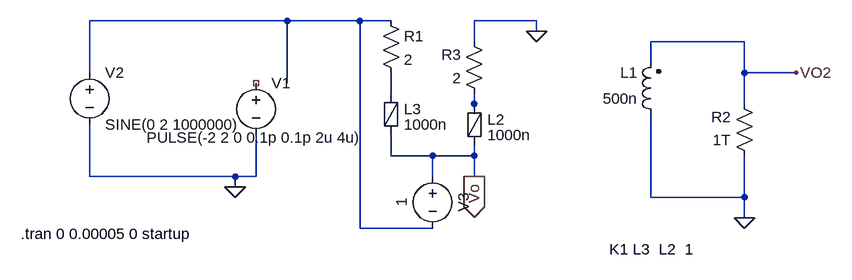
[diagram p0: schematic Draft4.asc]
Draft4.asc, the LTspice schematic file:
Version 4
SHEET 1 880 680
WIRE 0 16 -304 16
WIRE 112 16 0 16
WIRE 160 16 112 16
WIRE 384 16 288 16
WIRE 384 32 384 16
WIRE 288 48 288 16
WIRE 704 48 560 48
WIRE 560 80 560 48
WIRE -304 96 -304 16
WIRE 704 96 704 48
WIRE 784 96 704 96
WIRE 0 112 0 16
WIRE 160 128 160 96
WIRE 288 144 288 128
WIRE 704 144 704 96
WIRE 288 160 288 144
WIRE 160 224 160 192
WIRE 224 224 160 224
WIRE 288 224 288 208
WIRE 288 224 224 224
WIRE -304 256 -304 176
WIRE -80 256 -304 256
WIRE -48 256 -48 192
WIRE -48 256 -80 256
WIRE 224 256 224 224
WIRE 288 256 288 224
WIRE -80 272 -80 256
WIRE 560 288 560 160
WIRE 704 288 704 224
WIRE 704 288 560 288
WIRE 704 320 704 288
WIRE 112 336 112 16
WIRE 224 336 112 336
FLAG 288 256 Vo
IOPIN 288 256 Out
FLAG -80 272 0
FLAG 784 96 VO2
FLAG 704 320 0
FLAG 384 32 0
SYMBOL FerriteBead 160 160 R0
SYMATTR InstName L3
SYMATTR Value 1000n
SYMATTR SpiceLine Ipk=0.2 Rser=0.562 Rpar=750 Cpar=350f
SYMBOL voltage -48 96 R0
WINDOW 3 -168 100 Left 2
WINDOW 123 -119 137 Left 2
WINDOW 39 0 0 Left 0
SYMATTR InstName V1
SYMATTR Value PULSE(-2 2 0 0.1p 0.1p 2u 4u)
SYMBOL res 144 0 R0
SYMATTR InstName R1
SYMATTR Value 2
SYMBOL ind2 576 176 R180
WINDOW 0 36 80 Left 2
WINDOW 3 36 40 Left 2
SYMATTR InstName L1
SYMATTR Value 500n
SYMATTR Type ind
SYMBOL voltage -304 80 R0
WINDOW 123 0 0 Left 0
WINDOW 39 0 0 Left 0
SYMATTR InstName V2
SYMATTR Value SINE(0 2 1000000)
SYMBOL voltage 224 240 R0
WINDOW 0 32 56 VTop 2
WINDOW 3 -32 56 VBottom 2
WINDOW 123 24 56 VBottom 2
WINDOW 39 -4 56 VBottom 2
SYMATTR InstName V3
SYMATTR Value 1
SYMBOL FerriteBead 288 176 R0
SYMATTR InstName L2
SYMATTR Value 1000n
SYMATTR SpiceLine Ipk=0.2 Rser=0.562 Rpar=750 Cpar=350f
SYMBOL res 304 144 R180
WINDOW 0 36 76 Left 2
WINDOW 3 36 40 Left 2
SYMATTR InstName R3
SYMATTR Value 2
SYMBOL res 720 240 R180
WINDOW 0 36 76 Left 2
WINDOW 3 36 40 Left 2
SYMATTR InstName R2
SYMATTR Value 1T
TEXT -410 344 Left 2 !.tran 0 0.00005 0 startup
TEXT 496 368 Left 2 !K1 L3  L2  1

The netlist it stands for:
* Draft4.asc
L3 N002 Vo 1000n Ipk=0.2 Rser=0.562 Rpar=750 Cpar=350f
V1 NC_01 0 PULSE(-2 2 0 0.1p 0.1p 2u 4u)
R1 N001 N002 2
L1 0 VO2 500n
V2 N001 0 SINE(0 2 1000000)
V3 Vo N001 1
L2 N003 Vo 1000n Ipk=0.2 Rser=0.562 Rpar=750 Cpar=350f
R3 N003 0 2
R2 0 VO2 1T
.tran 0 0.00005 0 startup
K1 L3  L2  1
.backanno
.end